# Altium schematic sheet Top.SchDoc: G-2 Low Voltage Top Design
size B; Date: 19/01/2016; Author: Samer Kilani; DrawnBy: Samer Kilani; Engineer: Samer Kilani; Organization: UCL; DocumentNumber: 1; Revision: 2.0; SheetNumber: 1; SheetTotal: 4
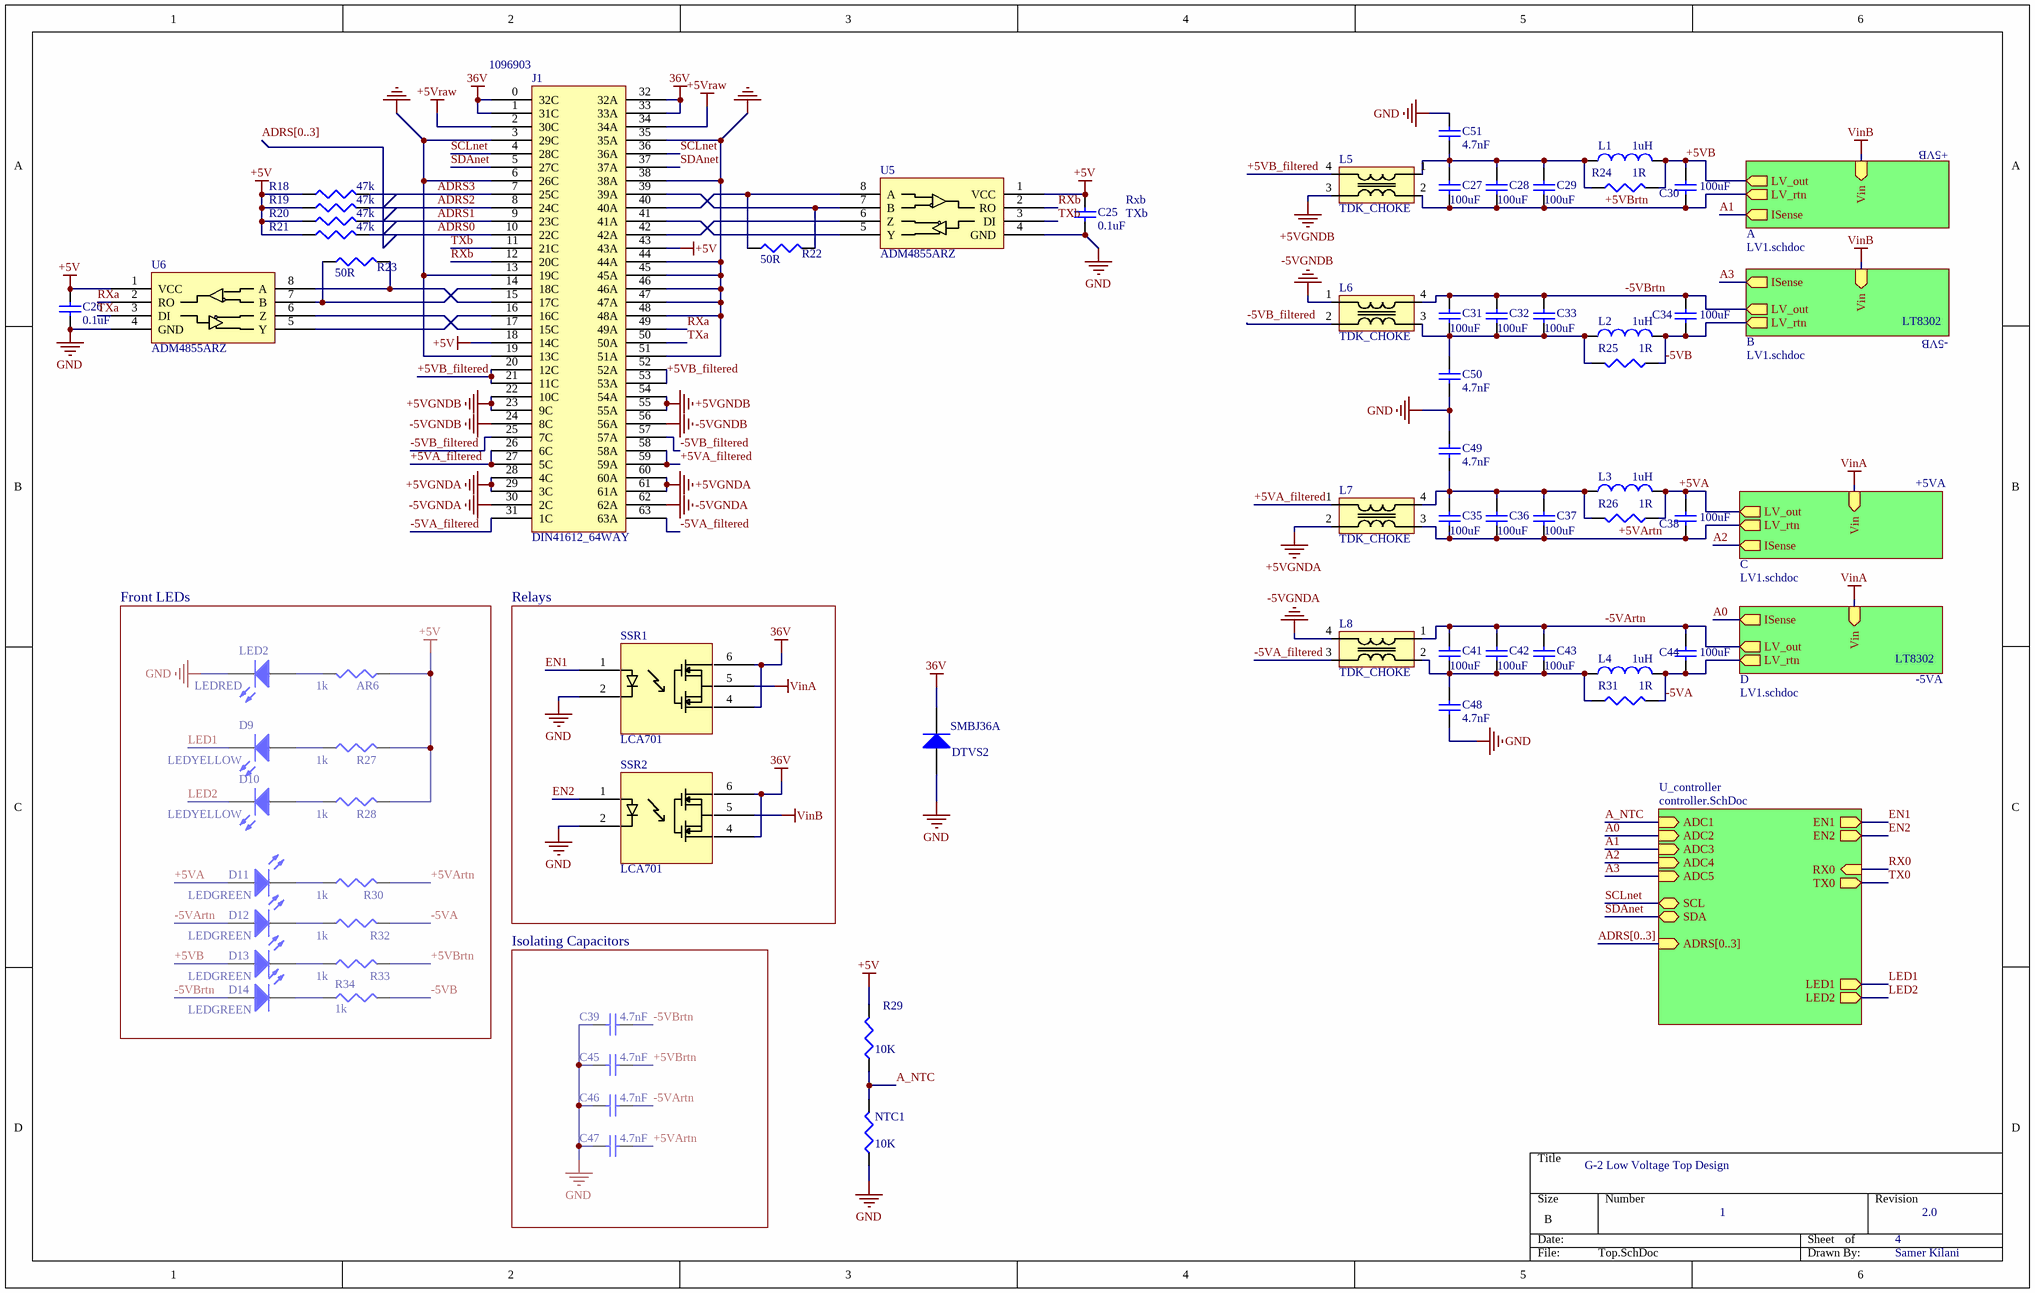
[diagram p0: Top.SchDoc]

## Parts
AR6  value 1k  [J1-0603]
C25  value 0.1uF  [1608[0603]]  (hidden comment: Cap Semi)
C26  value 0.1uF  [1608[0603]]  (hidden comment: Cap Semi)
C27  value 100uF  [C1210]  (hidden comment: Cap Semi)
C28  value 100uF  [C1210]  (hidden comment: Cap Semi)
C29  value 100uF  [C1210]  (hidden comment: Cap Semi)
C30  value 100uF  [C1210]  (hidden comment: Cap Semi)
C31  value 100uF  [C1210]  (hidden comment: Cap Semi)
C32  value 100uF  [C1210]  (hidden comment: Cap Semi)
C33  value 100uF  [C1210]  (hidden comment: Cap Semi)
C34  value 100uF  [C1210]  (hidden comment: Cap Semi)
C35  value 100uF  [C1210]  (hidden comment: Cap Semi)
C36  value 100uF  [C1210]  (hidden comment: Cap Semi)
C37  value 100uF  [C1210]  (hidden comment: Cap Semi)
C38  value 100uF  [C1210]  (hidden comment: Cap Semi)
C39  value 4.7nF  [1812]  (hidden comment: Cap Semi)
C41  value 100uF  [C1210]  (hidden comment: Cap Semi)
C42  value 100uF  [C1210]  (hidden comment: Cap Semi)
C43  value 100uF  [C1210]  (hidden comment: Cap Semi)
C44  value 100uF  [C1210]  (hidden comment: Cap Semi)
C45  value 4.7nF  [1812]  (hidden comment: Cap Semi)
C46  value 4.7nF  [1812]  (hidden comment: Cap Semi)
C47  value 4.7nF  [1812]  (hidden comment: Cap Semi)
C48  value 4.7nF  [1812]  (hidden comment: Cap Semi)
C49  value 4.7nF  [1812]  (hidden comment: Cap Semi)
C50  value 4.7nF  [1812]  (hidden comment: Cap Semi)
C51  value 4.7nF  [1812]  (hidden comment: Cap Semi)
D9  LEDYELLOW  [LEDYELLOW]
D10  LEDYELLOW  [LEDYELLOW]
D11  LEDGREEN  [LEDGREEN]
D12  LEDGREEN  [LEDGREEN]
D13  LEDGREEN  [LEDGREEN]
D14  LEDGREEN  [LEDGREEN]
DTVS2  PartNo: SMBJ36A  [SMBJ]  (hidden comment: SMBJ48A)
J1  DIN41612_64WAY  Supplier Part Number 1: 1096903  [09 03 164 6919]
L1  value 1uH  [MPLC0730]  (hidden comment: Inductor)
L2  value 1uH  [MPLC0730]  (hidden comment: Inductor)
L3  value 1uH  [MPLC0730]  (hidden comment: Inductor)
L4  value 1uH  [MPLC0730]  (hidden comment: Inductor)
L5  TDK_CHOKE  [ACMV_TDK]
L6  TDK_CHOKE  [ACMV_TDK]
L7  TDK_CHOKE  [ACMV_TDK]
L8  TDK_CHOKE  [ACMV_TDK]
LED2  LEDRED  [LEDRED]
NTC1  value 10K  [J1-0603]
R18  value 47k  [J1-0603]  (hidden comment: Res3)
R19  value 47k  [J1-0603]  (hidden comment: Res3)
R20  value 47k  [J1-0603]  (hidden comment: Res3)
R21  value 47k  [J1-0603]  (hidden comment: Res3)
R22  value 50R  [J1-0603]
R23  value 50R  [J1-0603]
R24  value 1R  [J1-0603]  (hidden comment: Res3)
R25  value 1R  [J1-0603]  (hidden comment: Res3)
R26  value 1R  [J1-0603]  (hidden comment: Res3)
R27  value 1k  [J1-0603]  (hidden comment: Res3)
R28  value 1k  [J1-0603]  (hidden comment: Res3)
R29  value 10K  [J1-0603]
R30  value 1k  [J1-0603]  (hidden comment: Res3)
R31  value 1R  [J1-0603]  (hidden comment: Res3)
R32  value 1k  [J1-0603]  (hidden comment: Res3)
R33  value 1k  [J1-0603]  (hidden comment: Res3)
R34  value 1k  [J1-0603]  (hidden comment: Res3)
SSR1  LCA701  [LCA701S]
SSR2  LCA701  [LCA701S]
U5  ADM4855ARZ  [SOICN8]
U6  ADM4855ARZ  [SOICN8]

## Blocks framed on the sheet
Front LEDs: AR6 D9-D14 LED2 R27 R28 R30 R32-R34
Relays: SSR1 SSR2
Isolating Capacitors: C39 C45-C47

## Sub-sheets
A = LV1.schdoc: LV_out (out), LV_rtn (out), ISense (out), Vin (in)
B = LV1.schdoc: LV_out (out), LV_rtn (out), ISense (out), Vin (in)
C = LV1.schdoc: LV_out (out), LV_rtn (out), ISense (out), Vin (in)
D = LV1.schdoc: LV_out (out), LV_rtn (out), ISense (out), Vin (in)
U_controller = controller.SchDoc: EN1 (out), ADC1 (in), ADC2 (in), EN2 (out), ADC3 (in), ADC4 (in), SCL (bidir), SDA (bidir), RX0 (in), TX0 (out), ADC5 (in), LED1 (out), LED2 (out), ADRS[0..3] (in)

## Nets
36V: DTVS2.1(K) J1.0(32C) J1.1(31C) J1.32(32A) J1.33(33A) SSR1.4 SSR1.6 SSR2.4 SSR2.6
+5V: AR6.1 C25.2 C26.2 J1.18(14C) J1.43(43A) R18.1 R19.1 R20.1 R21.1 R27.2 R28.2 R29.2 U5.1(VCC) U6.1(VCC)
+5VGNDA: J1.28(4C) J1.29(3C) J1.60(60A) J1.61(61A) L7.2
+5VGNDB: J1.22(10C) J1.23(9C) J1.54(54A) J1.55(55A) L5.3
+5Vraw: J1.2(30C) J1.34(34A)
-5VGNDA: J1.30(2C) J1.62(62A) L8.4
-5VGNDB: J1.24(8C) J1.56(56A) L6.1
GND: C25.1 C26.1 C39.1 C45.1 C46.1 C47.1 C48.1 C49.2 C50.1 C51.2 DTVS2.2(A) J1.3(29C) J1.6(26C) J1.13(19C) J1.19(13C) J1.35(35A) J1.38(38A) J1.44(44A) J1.45(45A) J1.46(46A) J1.47(47A) J1.48(48A) J1.51(51A) LED2.1(K) NTC1.1 SSR1.2 SSR2.2 U5.4(GND) U6.4(GND)
VinA: SSR1.5 ; sheet D/Vin, sheet C/Vin
VinB: SSR2.5 ; sheet B/Vin, sheet A/Vin
+5VA: C38.1 D11.2(A) L3.2 R26.1 ; sheet C/LV_out
+5VA_filtered: J1.26(6C) J1.27(5C) J1.58(58A) J1.59(59A) L7.1
+5VArtn: C35.2 C36.2 C37.2 C38.2 C47.2 L7.3 R30.2 ; sheet C/LV_rtn
+5VB: C30.2 D13.2(A) L1.2 R24.2 ; sheet A/LV_out
+5VB_filtered: J1.20(12C) J1.21(11C) J1.52(52A) J1.53(53A) L5.4
+5VBrtn: C27.1 C28.1 C29.1 C30.1 C45.2 L5.2 R33.2 ; sheet A/LV_rtn
-5VA: C44.1 L4.2 R31.2 R32.2 ; sheet D/LV_rtn
-5VA_filtered: J1.31(1C) J1.63(63A) L8.3
-5VArtn: C41.2 C42.2 C43.2 C44.2 C46.2 D12.2(A) L8.1 ; sheet D/LV_out
-5VB: C34.2 L2.2 R25.1 R34.2 ; sheet B/LV_rtn
-5VB_filtered: J1.25(7C) J1.57(57A) L6.2
-5VBrtn: C31.1 C32.1 C33.1 C34.1 C39.2 D14.2(A) L6.4 ; sheet B/LV_out
A0: sheet D/ISense, sheet U_controller/ADC2
A1: sheet U_controller/ADC3, sheet A/ISense
A2: sheet U_controller/ADC4, sheet C/ISense
A3: sheet B/ISense, sheet U_controller/ADC5
A_NTC: NTC1.2 R29.1 ; sheet U_controller/ADC1
ADRS0: J1.10(22C) R21.2
ADRS1: J1.9(23C) R20.2
ADRS2: J1.8(24C) R19.2
ADRS3: J1.7(25C) R18.2
EN1: SSR1.1 ; sheet U_controller/EN1
EN2: SSR2.1 ; sheet U_controller/EN2
LED1: D9.1(K) ; sheet U_controller/LED1
LED2: D10.1(K) ; sheet U_controller/LED2
RX0: sheet U_controller/RX0
RXa: J1.49(49A) U6.2(RO)
RXb: J1.12(20C) U5.2(RO)
SCLnet: J1.4(28C) J1.36(36A) ; sheet U_controller/SCL
SDAnet: J1.5(27C) J1.37(37A) ; sheet U_controller/SDA
TX0: sheet U_controller/TX0
TXa: J1.50(50A) U6.3(DI)
TXb: J1.11(21C) U5.3(DI)
NetAR6_2: AR6.2 LED2.2(A)
NetC27_2: C27.2 C28.2 C29.2 C51.1 L1.1 L5.1 R24.1
NetC31_2: C31.2 C32.2 C33.2 C50.2 L2.1 L6.3 R25.2
NetC35_1: C35.1 C36.1 C37.1 C49.1 L3.1 L7.4 R26.2
NetC41_1: C41.1 C42.1 C43.1 C48.2 L4.1 L8.2 R31.1
NetD9_2: D9.2(A) R27.1
NetD10_2: D10.2(A) R28.1
NetD11_1: D11.1(K) R30.1
NetD12_1: D12.1(K) R32.1
NetD13_1: D13.1(K) R33.1
NetD14_1: D14.1(K) R34.1
NetJ1_14: J1.14(18C) R23.1 U6.7(B)
NetJ1_15: J1.15(17C) R23.2 U6.8(A)
NetJ1_16: J1.16(16C) U6.5(Y)
NetJ1_17: J1.17(15C) U6.6(Z)
NetJ1_39: J1.39(39A) R22.2 U5.7(B)
NetJ1_40: J1.40(40A) R22.1 U5.8(A)
NetJ1_41: J1.41(41A) U5.5(Y)
NetJ1_42: J1.42(42A) U5.6(Z)

## Buses and harness runs
bus ADRS[0..3]
bus ADRS[0..3] = sheet U_controller/ADRS[0..3]

## Notes on the sheet
- +5VB
- (near C25) Rxb
- (near C25) TXb
- LT3748
- LT8302
- -5VB
- +5VA
- -5VA

## Library data of the parts
AR6 R18-R34 = Res3: Resistor; Published: 8-Jun-2000; LatestRevisionDate: 29-May-2009; LatestRevisionNote: IPC-7351 Footprint Added.; PackageReference: J1-0603; Publisher: Altium Limited; PackageDescription: Chip Resistor
C25 C26 = Cap Semi: Capacitor (Semiconductor SIM Model); PartNo: CC0603KRX7R9BB104; Published: 8-Jun-2000; LatestRevisionDate: 29-May-2009; LatestRevisionNote: IPC-7351 Footprint Added.; PackageReference: C1206; Publisher: Altium Limited; PackageDescription: Chip Capacitor
C27-C29 C31-C33 C35-C37 C41-C43 = Cap Semi: Capacitor (Semiconductor SIM Model); PartNo: CL32A107MPVNNNE; Published: 8-Jun-2000; LatestRevisionDate: 29-May-2009; LatestRevisionNote: IPC-7351 Footprint Added.; PackageReference: C1206; Publisher: Altium Limited; PackageDescription: Chip Capacitor
C30 C34 C38 C44 = Cap Semi: Capacitor (Semiconductor SIM Model); PartNo: C3225X5R0J107M250AC; Published: 8-Jun-2000; LatestRevisionDate: 29-May-2009; LatestRevisionNote: IPC-7351 Footprint Added.; PackageReference: C1206; Publisher: Altium Limited; PackageDescription: Chip Capacitor
C39 C45-C51 = Cap Semi: Capacitor (Semiconductor SIM Model); PartNo: C1812C472KDRACTU; Published: 8-Jun-2000; LatestRevisionDate: 29-May-2009; LatestRevisionNote: IPC-7351 Footprint Added.; PackageReference: C1206; Publisher: Altium Limited; PackageDescription: Chip Capacitor
D9 D10 = LEDYELLOW: PartNo: 550-0307F
D11-D14 = LEDGREEN: PartNo: 550-0207F
  D11: Supplier 1: RS-Components; Supplier Part Number 1: 890-6921
DTVS2 = SMBJ: TVS; Note: Pin 2 is not connected and not drawn.; Published: 21-Mar-2003; LatestRevisionDate: 29-May-2009; LatestRevisionNote: IPC-7351 Footprint Added.; DatasheetVersion: Oct-1999; PackageVersion: Sep-2001; PackageReference: SOT-23; Publisher: Altium Limited; PackageDescription: 3-Pin SOT-23 Package 0.95 mm Pitch, 2.5 mm Lead Span; ComponentLink1Description: Manufacturer Link; ComponentLink1URL: http://www.infineon.com/; ComponentLink2Description: Datasheet; ComponentLink2URL: http://www.infineon.com/upload/Document/cmc_upload/documents/080/656/bas116series.pdf
J1 = DIN41612_64WAY: PartNo: 0903 164 6921; Supplier 1: Farnell
L1-L4 = Inductor: PartNo: MPLC0730L1R0; Code_IEC: 1005; Published: 8-Jun-2000; LatestRevisionDate: 29-May-2009; LatestRevisionNote: IPC-7351 Footprint Added.; PackageReference: 0402-A; Publisher: Altium Limited; PackageDescription: Chip Inductor; Code_JEITA: 0402
L5-L8 = TDK_CHOKE: PartNo: ACM90V-701-2PL
LED2 = LEDRED: PartNo: 550-0407F
NTC1 = Res3: Resistor; PartNo: NCP18XH103J03RB; Published: 8-Jun-2000; LatestRevisionDate: 29-May-2009; LatestRevisionNote: IPC-7351 Footprint Added.; PackageReference: J1-0603; Publisher: Altium Limited; PackageDescription: Chip Resistor
U5 U6 = SP3084EEN-L: PartNo: ADM4855ARZ
SSR1 SSR2 = LCA701: PartNo: LCA701S